# Altium schematic sheet HDMI Connector for RK3399.SchDoc
size A4; SheetNumber: 10; SheetTotal: 26
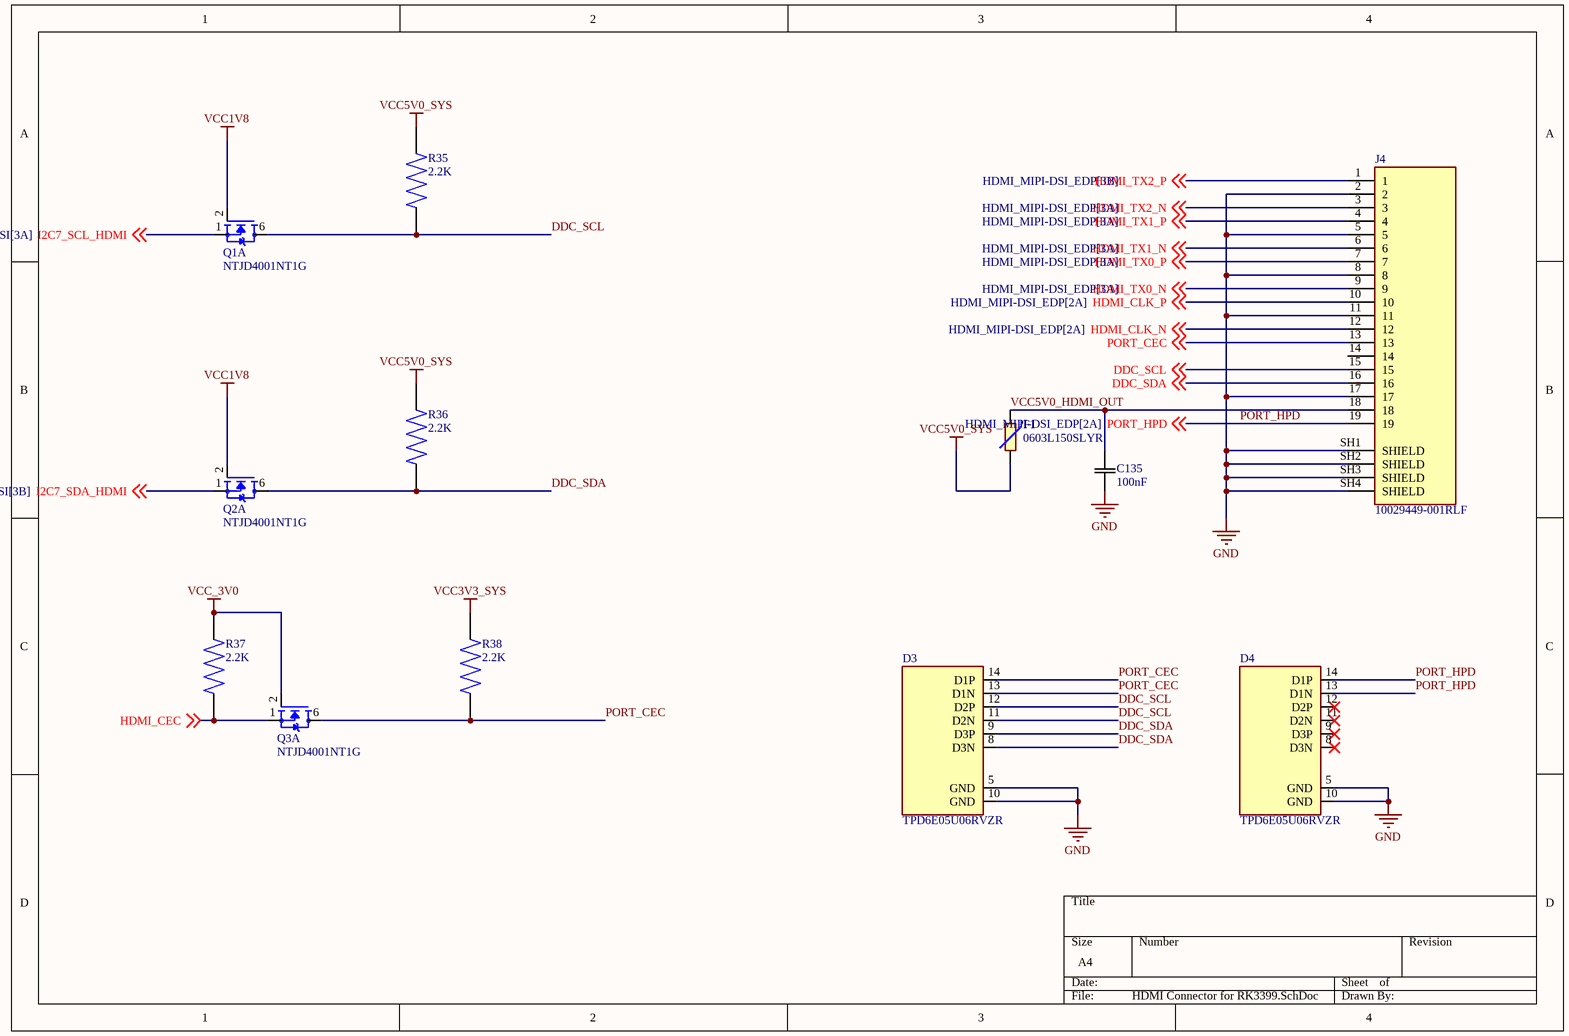
[diagram p0: HDMI Connector for RK3399.SchDoc]

## Parts
C135  100nF  [CAP_1005_TDK]
D3  TPD6E05U06RVZR  [SON50P135X350X55-14N]
D4  TPD6E05U06RVZR  [SON50P135X350X55-14N]
F1  0603L150SLYR  [FUSC1608X100N]
J4  10029449-001RLF  [AMPHENOL_10029449-001RLF]
Q1  NTJD4001NT1G  [SOT65P210X110-6N]  (part A of 2)
Q2  NTJD4001NT1G  [SOT65P210X110-6N]  (part A of 2)
Q3  NTJD4001NT1G  [SOT65P210X110-6N]  (part A of 2)
R35  2.2K  [RES_ERA8APB222V]
R36  2.2K  [RES_ERA8APB222V]
R37  2.2K  [RES_ERA8APB222V]
R38  2.2K  [RES_ERA8APB222V]

## Nets
GND: C135.2 D3.5(GND) D3.10(GND) D4.5(GND) D4.10(GND) J4.2 J4.5 J4.8 J4.11 J4.17 J4.SH1(SHIELD) J4.SH2(SHIELD) J4.SH3(SHIELD) J4.SH4(SHIELD)
VCC1V8: Q1.2(G1) Q2.2(G1)
VCC3V3_SYS: R38.2
VCC5V0_SYS: F1.2 R35.2 R36.2
VCC_3V0: Q3.2(G1) R37.2
DDC_SCL: D3.11(D2N) D3.12(D2P) J4.15 Q1.6(D1) R35.1 ; off-sheet DDC_SCL
DDC_SDA: D3.8(D3N) D3.9(D3P) J4.16 Q2.6(D1) R36.1 ; off-sheet DDC_SDA
HDMI_CEC: Q3.1(S1) R37.1 ; off-sheet HDMI_CEC
HDMI_CLK_N: J4.12 ; off-sheet HDMI_CLK_N
HDMI_CLK_P: J4.10 ; off-sheet HDMI_CLK_P
HDMI_TX0_N: J4.9 ; off-sheet HDMI_TX0_N
HDMI_TX0_P: J4.7 ; off-sheet HDMI_TX0_P
HDMI_TX1_N: J4.6 ; off-sheet HDMI_TX1_N
HDMI_TX1_P: J4.4 ; off-sheet HDMI_TX1_P
HDMI_TX2_N: J4.3 ; off-sheet HDMI_TX2_N
HDMI_TX2_P: J4.1 ; off-sheet HDMI_TX2_P
I2C7_SCL_HDMI: Q1.1(S1) ; off-sheet I2C7_SCL_HDMI
I2C7_SDA_HDMI: Q2.1(S1) ; off-sheet I2C7_SDA_HDMI
PORT_CEC: D3.13(D1N) D3.14(D1P) J4.13 Q3.6(D1) R38.1 ; off-sheet PORT_CEC
PORT_HPD: D4.13(D1N) D4.14(D1P) J4.19 ; off-sheet PORT_HPD
VCC5V0_HDMI_OUT: C135.1 F1.1 J4.18

Not connected (* = marked no-connect by the designer): D4 8(D3N)* 9(D3P)* 11(D2N)* 12(D2P)*; J4 14

## Library data of the parts
C135 = C1005X7R1H104M050BB: Description; Manufacturer_Name: TDK; Copyright: Copyright (C) 2025 Ultra Librarian. All rights reserved.; Manufacturer_Part_Number: C1005X7R1H104M050BB
D3 D4 = TPD6E05U06RVZR: 6-Channel Ultra low capacitance IEC ESD protection diodes 14-USON -40 to 125; MP: TPD6E05U06RVZR; Price: None; Package: None; Value: *; Availability: Unavailable
F1 = 0603L150SLYR: Polymeric PTC Resettable Fuse 6V 1.5 A Ih Surface Mount 0603 (1608 Metric), Concave; MF: Littelfuse Inc.; SnapEDA_Link: https://www.snapeda.com/parts/0603L150SLYR/Littelfuse/view-part/?ref=snap; Package: 0603-2 LITTELFUSE; Value: *; MP: 0603L150SLYR; Check_prices: https://www.snapeda.com/parts/0603L150SLYR/Littelfuse/view-part/?ref=eda
Q1-Q3 = NTJD4001NT1G: Mosfet Array 2 N-Channel (Dual) 30V 250mA 272mW Surface Mount SC-88/SC70-6/SOT-363; MF: ON Semiconductor; SnapEDA_Link: https://www.snapeda.com/parts/NTJD4001NT1G/Onsemi/view-part/?ref=snap; Package: SC-88-6 ON Semiconductor; Value: *; MP: NTJD4001NT1G; Check_prices: https://www.snapeda.com/parts/NTJD4001NT1G/Onsemi/view-part/?ref=eda
R35-R38 = ERA8APB222V: Availability: Unavailable; Price: None; Package: None; MP: ERA8APB222V; Value: *
J4 = 10029449-001RLF: Package: None; Price: None; Value: *; MP: 10029449-001RLF; Availability: Unavailable